# EAGLE design Stand Sensor (EAGLE 6.5.0)
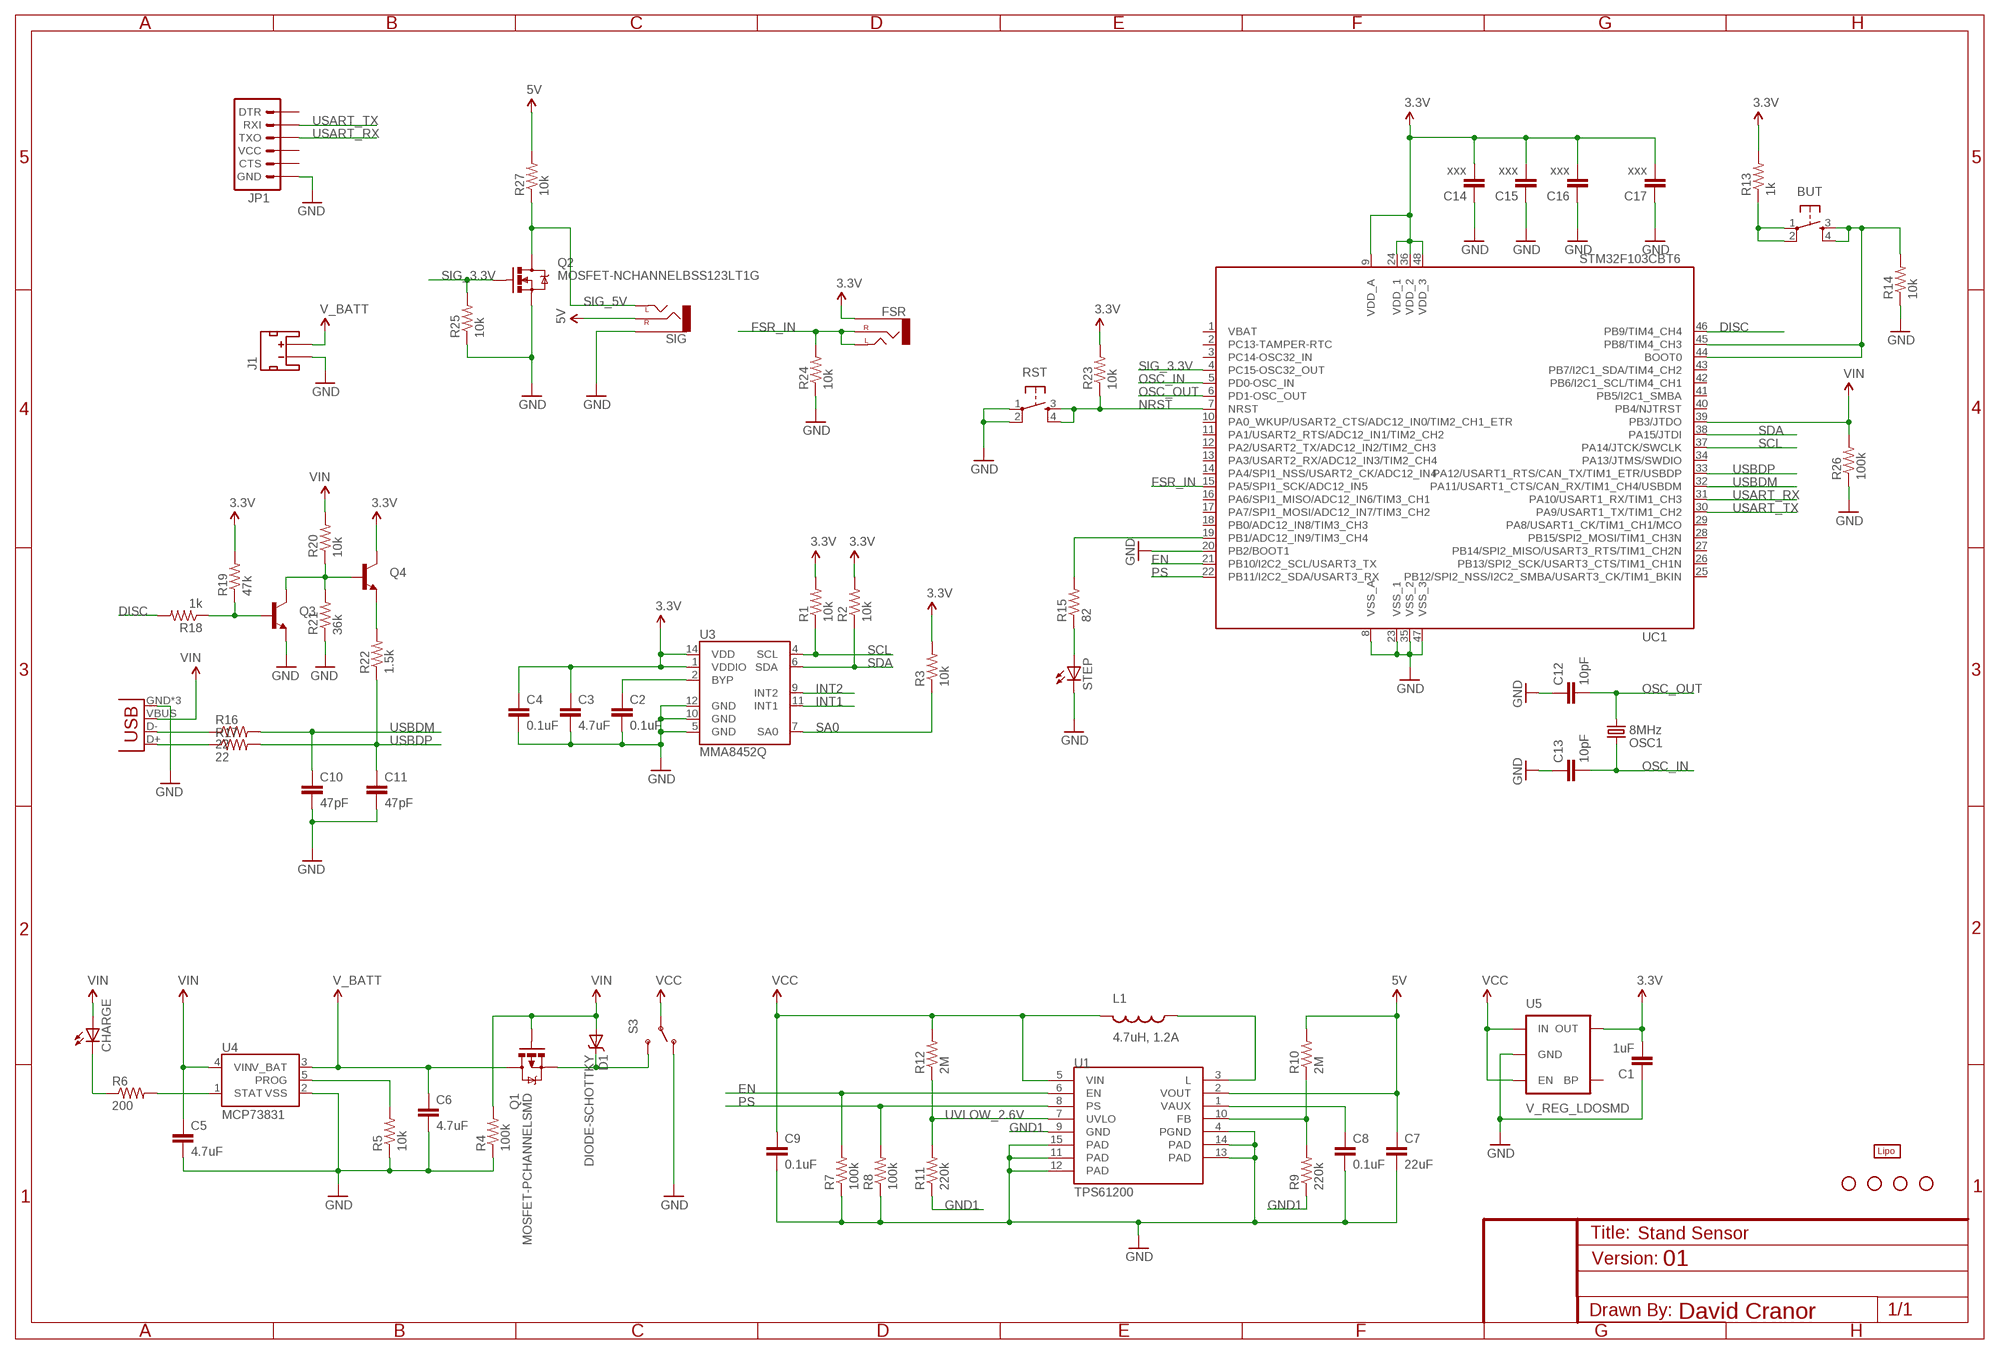
[diagram p0: schematic, sheet 1]

## Parts
BUT  TAC_SWITCHSMD  [TACTILE_SWITCH_SMD]
C1  1uF  CAP1206  [1206]
C2  0.1uF  CAP1206  [1206]
C3  4.7uF  CAP1206  [1206]
C4  0.1uF  CAP1206  [1206]
C5  4.7uF  CAP1206  [1206]
C6  4.7uF  CAP1206  [1206]
C7  22uF  CAP1206  [1206]
C8  0.1uF  CAP1206  [1206]
C9  0.1uF  CAP1206  [1206]
C10  47pF  CAP1206  [1206]
C11  47pF  CAP1206  [1206]
C12  10pF  CAP1206  [1206]
C13  10pF  CAP1206  [1206]
C14  xxx  CAP1206  [1206]
C15  xxx  CAP1206  [1206]
C16  xxx  CAP1206  [1206]
C17  xxx  CAP1206  [1206]
CHARGE  LED1206  [LED-1206]
D1  DIODE-SCHOTTKY  [SOD-523]
FSR  AUDIO-JACKPTH  [AUDIO-JACK]
J1  JST_2MM_MALE  [JST-2-SMD]
JP1  ARDUINO_SERIAL_PROGRAMSMD  [1X06-SMD]
L1  4.7uH, 1.2A  INDUCTOR.  [CDRH2D09]
OSC1  8MHz  CRYSTAL5X3  [CRYSTAL-SMD-5X3]
Q1  MOSFET-PCHANNELSMD  [SOT23-3]
Q2  MOSFET-NCHANNELBSS123LT1G  [SOT23]
Q3  TRANSISTOR_NPNSOT23  [SOT23]
Q4  TRANSISTOR_NPNSOT23  [SOT23]
R1  10k  RESISTOR1206  [1206]
R2  10k  RESISTOR1206  [1206]
R3  10k  RESISTOR1206  [1206]
R4  100k  RESISTOR1206  [1206]
R5  10k  RESISTOR1206  [1206]
R6  200  RESISTOR1206  [1206]
R7  100k  RESISTOR1206  [1206]
R8  100k  RESISTOR1206  [1206]
R9  220k  RESISTOR1206  [1206]
R10  2M  RESISTOR1206  [1206]
R11  220k  RESISTOR1206  [1206]
R12  2M  RESISTOR1206  [1206]
R13  1k  RESISTOR1206  [1206]
R14  10k  RESISTOR1206  [1206]
R15  82  RESISTOR1206  [1206]
R16  22  RESISTOR1206  [1206]
R17  22  RESISTOR1206  [1206]
R18  1k  RESISTOR1206  [1206]
R19  47k  RESISTOR1206  [1206]
R20  10k  RESISTOR1206  [1206]
R21  36k  RESISTOR1206  [1206]
R22  1.5k  RESISTOR1206  [1206]
R23  10k  RESISTOR1206  [1206]
R24  10k  RESISTOR1206  [1206]
R25  10k  RESISTOR1206  [1206]
R26  100k  RESISTOR1206  [1206]
R27  10k  RESISTOR1206  [1206]
RST  TAC_SWITCHSMD  [TACTILE_SWITCH_SMD]
S3  SWITCH-SPDTSMD  [AYZ0202]
SIG  AUDIO-JACKPTH  [AUDIO-JACK]
STANDOFF1  STAND-OFF  [STAND-OFF]
STANDOFF2  STAND-OFF  [STAND-OFF]
STANDOFF3  STAND-OFF  [STAND-OFF]
STANDOFF4  STAND-OFF  [STAND-OFF]
STEP  LED1206  [LED-1206]
U1  TPS61200  [QFN-10_PAD]
U3  MMA8452Q  [QFN-16_0.5MM]
U4  MCP73831  [SOT23-5]
U5  V_REG_LDOSMD  [SOT23-5]
U$1  LIPO-OUTLINE2000  [LIPO-2000]
UC1  STM32F103CBT6  STM32F103CB  [LQFP48]
USB  USB-MICROB  [USB-MICROB]

## Nets
3.3V: C1.2 C3.1 C4.1 C14.2 C15.2 C16.2 C17.2 FSR.SLEEVE Q4.3(C) R1.2 R2.2 R3.2 R13.2 R19.2 R23.2 U3.1(VDDIO) U3.14(VDD) U5.5(OUT) UC1.9(VDD_A) UC1.24(VDD_1) UC1.36(VDD_2) UC1.48(VDD_3)
5V: C7.1 R10.2 R27.2 SIG.RING(RIGHT) U1.2(VOUT)
D+: R17.1 USB.D+
D-: R16.1 USB.D-
DISC: R18.2 UC1.46(PB9/TIM4_CH4)
EN: R7.2 U1.6(EN) UC1.21(PB10/I2C2_SCL/USART3_TX)
FSR_IN: FSR.RING(RIGHT) FSR.TIP(LEFT) R24.2 UC1.15(PA5/SPI1_SCK/ADC12_IN5)
GND: C1.1 C2.2 C3.2 C4.2 C5.2 C6.2 C7.2 C8.2 C9.2 C10.2 C11.2 C12.1 C13.1 C14.1 C15.1 C16.1 C17.1 J1.1(-) JP1.6(GND) Q2.2(S) Q3.2(E) R4.1 R5.1 R7.1 R8.1 R14.1 R21.1 R24.1 R25.1 R26.1 RST.1 RST.2 S3.1(O) SIG.SLEEVE STEP.C U1.4(PGND) U1.11(PAD) U1.12(PAD) U1.13(PAD) U1.14(PAD) U1.15(PAD) U3.5(GND) U3.10(GND) U3.12(GND) U4.2(VSS) U5.2(GND) UC1.8(VSS_A) UC1.20(PB2/BOOT1) UC1.23(VSS_1) UC1.35(VSS_2) UC1.47(VSS_3) USB.GND USB.MT1(GND) USB.MT2(GND)
GND1: R9.1 R11.1 U1.9(GND)
INT1: U3.11(INT1)
INT2: U3.9(INT2)
N$1: C2.1 U3.2(BYP)
N$2: L1.P$1 U1.3(L)
N$3: R5.2 U4.5(PROG)
N$4: R6.2 U4.1(STAT)
N$5: CHARGE.C R6.1
N$6: D1.C Q1.2(S) S3.3(S)
N$7: C8.1 U1.1(VAUX)
N$8: R9.2 R10.1 U1.10(FB)
N$9: R15.2 UC1.19(PB1/ADC12_IN9/TIM3_CH4)
N$10: BUT.3 BUT.4 R14.2 UC1.44(BOOT0) UC1.45(PB8/TIM4_CH3)
N$11: R15.1 STEP.A
N$12: BUT.1 BUT.2 R13.1
N$13: Q3.1(B) R18.1 R19.1
N$14: Q3.3(C) Q4.1(B) R20.1 R21.2
N$18: Q4.2(E) R22.2
NRST: R23.1 RST.3 RST.4 UC1.7(NRST)
OSC_IN: C13.2 OSC1.3 UC1.5(PD0-OSC_IN)
OSC_OUT: C12.2 OSC1.1 UC1.6(PD1-OSC_OUT)
PS: R8.2 U1.8(PS) UC1.22(PB11/I2C2_SDA/USART3_RX)
SA0: R3.1 U3.7(SA0)
SCL: R1.1 U3.4(SCL) UC1.37(PA14/JTCK/SWCLK)
SDA: R2.1 U3.6(SDA) UC1.38(PA15/JTDI)
SIG_3.3V: Q2.1(G) R25.2 UC1.4(PC15-OSC32_OUT)
SIG_5V: Q2.3(D) R27.1 SIG.TIP(LEFT)
USART_RX: JP1.3(TXO) UC1.31(PA10/USART1_RX/TIM1_CH3)
USART_TX: JP1.2(RXI) UC1.30(PA9/USART1_TX/TIM1_CH2)
USBDM: C10.1 R16.2 UC1.32(PA11/USART1_CTS/CAN_RX/TIM1_CH4/USBDM)
USBDP: C11.1 R17.2 R22.1 UC1.33(PA12/USART1_RTS/CAN_TX/TIM1_ETR/USBDP)
UVLOW_2.6V: R11.2 R12.1 U1.7(UVLO)
V_BATT: C6.1 J1.2(+) Q1.3(D) U4.3(V_BAT)
VCC: C9.1 L1.P$2 R12.2 S3.2(P) U1.5(VIN) U5.1(IN) U5.3(EN)
VIN: C5.1 CHARGE.A D1.A Q1.1(G) R4.2 R20.2 R26.2 U4.4(VIN) UC1.39(PB3/JTDO) USB.VBUS
Unconnected: J1.NC1(PAD1) J1.NC2(PAD2) JP1.1(DTR) JP1.4(VCC) JP1.5(CTS) U5.4(BP) UC1.2(PC13-TAMPER-RTC) UC1.3(PC14-OSC32_IN) UC1.10(PA0_WKUP/USART2_CTS/ADC12_IN0/TIM2_CH1_ETR) UC1.11(PA1/USART2_RTS/ADC12_IN1/TIM2_CH2) UC1.12(PA2/USART2_TX/ADC12_IN2/TIM2_CH3) UC1.13(PA3/USART2_RX/ADC12_IN3/TIM2_CH4) UC1.14(PA4/SPI1_NSS/USART2_CK/ADC12_IN4) UC1.16(PA6/SPI1_MISO/ADC12_IN6/TIM3_CH1) UC1.17(PA7/SPI1_MOSI/ADC12_IN7/TIM3_CH2) UC1.18(PB0/ADC12_IN8/TIM3_CH3) UC1.25(PB12/SPI2_NSS/I2C2_SMBA/USART3_CK/TIM1_BKIN) UC1.26(PB13/SPI2_SCK/USART3_CTS/TIM1_CH1N) UC1.27(PB14/SPI2_MISO/USART3_RTS/TIM1_CH2N) UC1.28(PB15/SPI2_MOSI/TIM1_CH3N) UC1.29(PA8/USART1_CK/TIM1_CH1/MCO) UC1.34(PA13/JTMS/SWDIO) UC1.40(PB4/NJTRST) UC1.41(PB5/I2C1_SMBA) UC1.42(PB6/I2C1_SCL/TIM4_CH1) UC1.43(PB7/I2C1_SDA/TIM4_CH2)

## Notes on the sheet
- 01
- David Cranor

## Power pins joined to a net without a drawn wire
VBAT: UC1.1(VBAT)

## Library data of the parts
BUT RST = SparkFun-Electromechanical:TAC_SWITCH: Momentary Switch Button commonly used for reset or general input. Spark Fun Electronics SKU : COM-00097 SMT- SWCH-08247; PROD_ID: SWCH-08247
C1-C17 = SparkFun-Passives:CAP: Capacitor Standard 0603 ceramic capacitor, and 0.1" leaded capacitor.
CHARGE STEP = SparkFun-LED:LED: LEDs Standard schematic elements and footprints for 5mm, 3mm, 1206, and 0603 sized LEDs. 5mm - Spark Fun Electronics SKU : COM-00529 (and others)
D1 = SparkFun-DiscreteSemi:DIODE-SCHOTTKY: Commonly MBRA140.
FSR SIG = SparkFun-Connectors:AUDIO-JACK: 3.5mm Audio Jack Simple 3.5mm common PCB mount audio jack. SKU: PRT-08032
J1 = SparkFun-Connectors:JST_2MM_MALE: Mates to single-cell LiPo batteries. CONN-08352; PROD_ID: CONN-08352
JP1 = SparkFun-Connectors:ARDUINO_SERIAL_PROGRAM: FTDI connector footprints
L1 = SparkFun-Passives:INDUCTOR: Inductors Basic Inductor/Choke - 0603 and 1206. Footprints are not proven and vary greatly between part numbers. SRN6045- 33uH, 20% 1.4A
OSC1 = SparkFun2:CRYSTAL: Crystals Various standard crystals. Proven footprints. Spark Fun Electronics SKU : COM-00534
Q1 = SparkFun-DiscreteSemi:MOSFET-PCHANNEL: Generic PMOSFET
Q2 = SparkFun-DiscreteSemi:MOSFET-NCHANNEL: Common NMOSFET Parts MFG P/N Store ID Prod ID FDD8780 TRANS-09984 SI7820DN TRANS-11055 FDS6630A IC-08089 2N7002PW TRANS-11151 FQP30N06L COM-10213 TRANS-10060 BSS123LT1G TRANS-08345 BSS138 TRANS-00830 BS170 2N7000; PROD_ID: TRANS-08345
Q3 Q4 = SparkFun-DiscreteSemi:TRANSISTOR_NPN: Generic NPN BJT MMBT2222A - TRANS-08049 (SOT-23, 1A 40V) MPSA42 - TRANS-09116 (SOT-23, 500mA 300V) MMBT5088LT1G - TRANS-11160 (SOT-23, 50 mA 30V)
R1-R27 = SparkFun-Passives:RESISTOR: Resistor Basic schematic elements and footprints for 0603, 1206, and PTH resistors.
S3 = SparkFun-Electromechanical:SWITCH-SPDT: SPDT Switch Simple slide switch, Spark Fun Electronics SKU : COM-00102 DPDT SMT slide switch, AYZ0202, SWCH-08179; PROD_ID: SWCH-08179
STANDOFF1-STANDOFF4 = SparkFun-Electromechanical:STAND-OFF: #4 Stand Off This is the mechanical footprint for a #4 phillips button head screw. Use the keepout ring to avoid running the screw head into surrounding components. SKU : PRT-00447
U1 = SparkFun-PowerIC:TPS61200: DC to DC Booster IC-10035; PROD_ID: IC-10035
U3 = SparkFun-Sensors:MMA8452Q: MMA8452Q 3-Axis, 12/8-bit Digital Accelerometer Supply Voltage: 1.6-3.6V Range: +/- 2g, 4g, 8g Interface: I2C, 12-bit and 8-bit ODR: 1.56 Hz - 800 Hz Package: QFN-16 http://cache.freescale.com/files/sensors/doc/data_sheet/MMA8452Q.pdf; PROD_ID: IC-10769
U4 = SparkFun-PowerIC:MCP73831: Miniature single cell, fully integrated Li-Ion, Li-polymer charge management controller http://ww1.microchip.com/downloads/en/DeviceDoc/21984a.pdf IC-09995; PROD_ID: IC-09995
U5 = SparkFun-PowerIC:V_REG_LDO: Voltage Regulator LDO Standard 150mA LDO voltage regulator in SOT-23 layout. Micrel part MIC5205. BP (by-pass) pin is used to lower output noise with 470pF cap.
U$1 = SparkFun-Electromechanical:LIPO-OUTLINE: Outlines for common LiPo batteries sold by SparkFun. For fit only- no pads or connectors!
UC1 = stm32:STM32F103CB
USB = SparkFun-Connectors:USB: USB Connectors USB-B-PTH is fully proven SKU : PRT-00139/CONN-08278 USB-miniB is fully proven SKU : PRT-00587 USB-A-PCB is untested. USB-A-H is throughly reviewed, but untested. Spark Fun Electronics SKU : PRT-00437 USB-B-SMT is throughly reviewed, but untested. Needs silkscreen touching up. USB-A-S has not been used/tested USB-MB-H has not been used/tested USB-MICROB has been used. CONN-09505; PROD_ID: CONN-09505

## Board
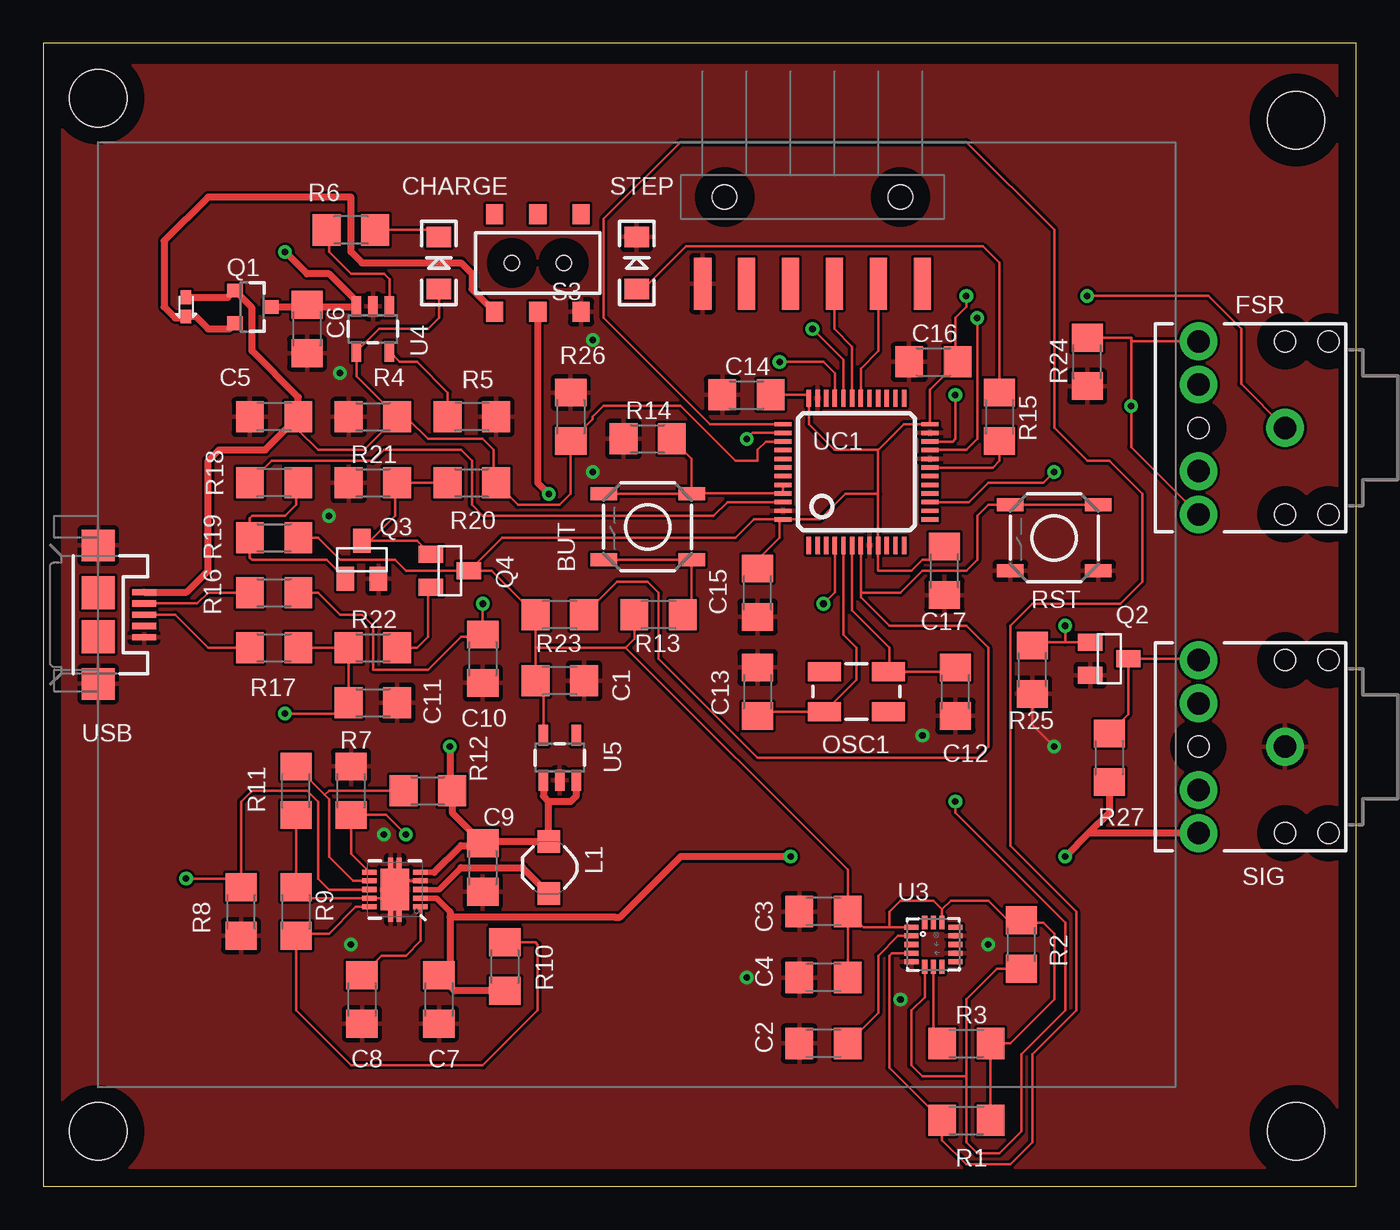
[diagram p1: board, top side]
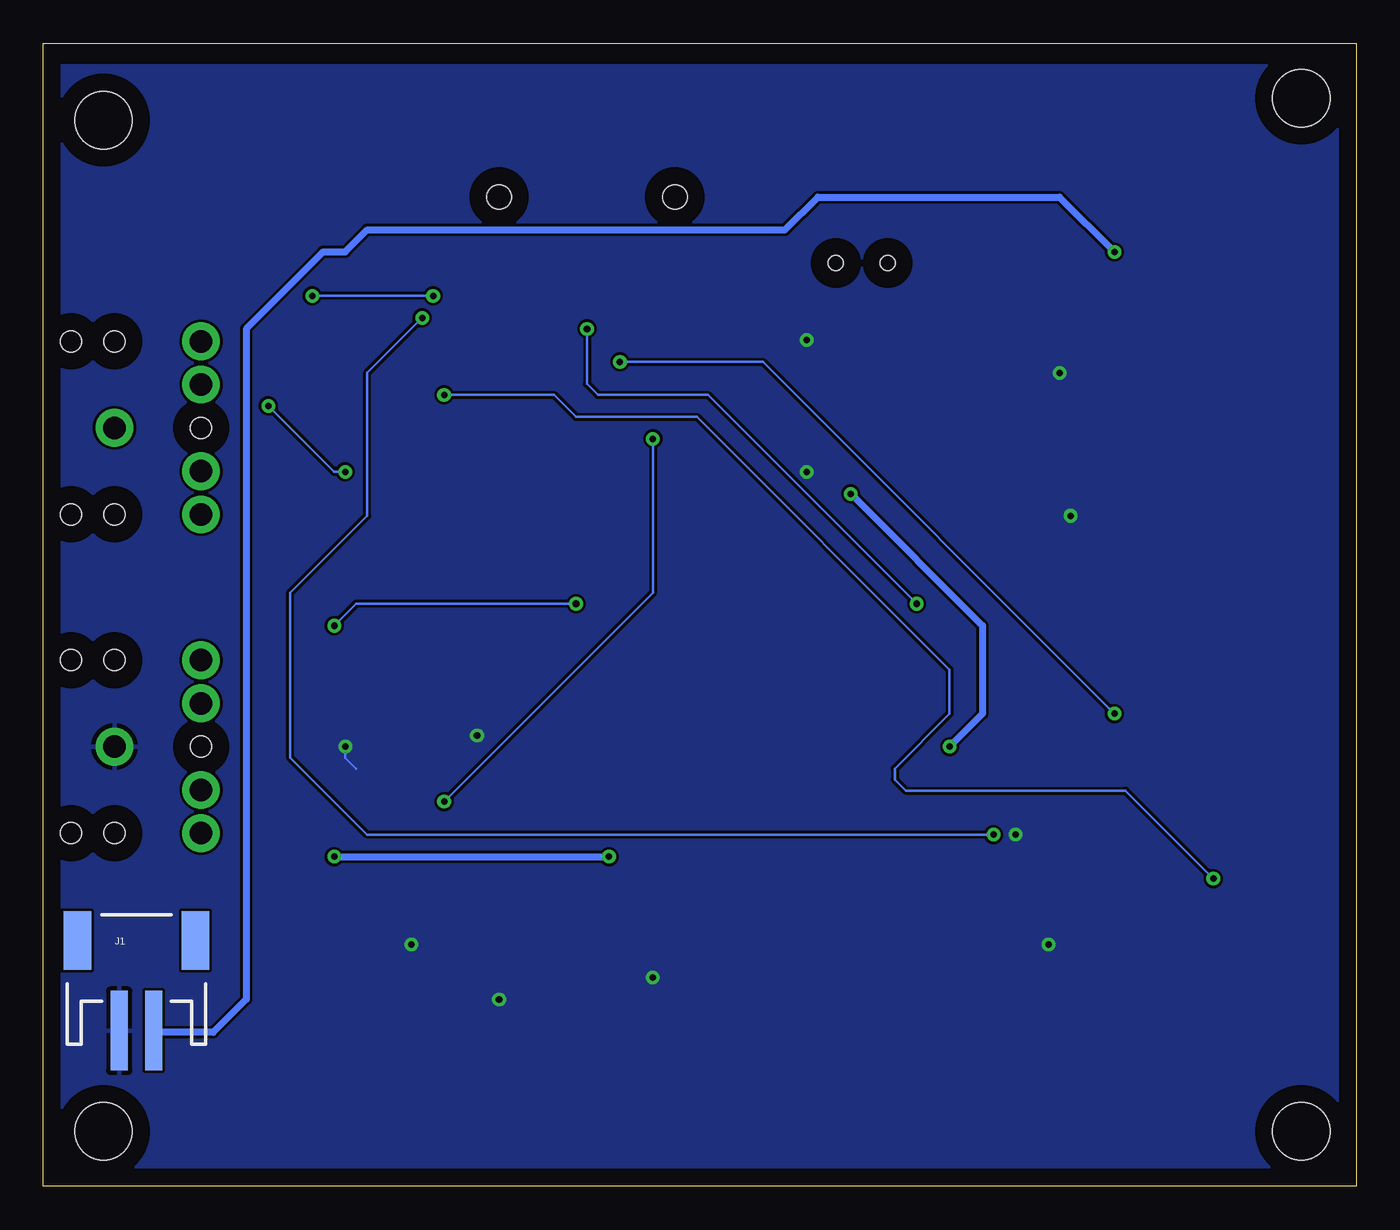
[diagram p2: board, bottom side, seen from below]

Size 75.87 x 66.03 mm. Coordinates in mm from the lower left corner, seen from the top.
Outline: 0,0 75.87,0 75.87,66.03 0,66.03 0,0
Copper layers (1*16): Top 0.035mm / dielectric 1.5mm / Bottom 0.035mm
Design rules "default *": minimum track width 6mil, minimum drill 15mil, track to track 6mil, track to pad 6mil, pad to pad 6mil, via to via 6mil, smd to smd 6mil, copper to edge 40mil, drill to drill 6mil, minimum pad ring 10mil, minimum via ring 8mil, stop-mask expansion 4mil, vias tented up to drill 0mil, thermal gap 10mil

### Footprints (pad centres in the part's own frame; a part is rotated, then mirrored left to right if it is on the bottom)
TACTILE_SWITCH_SMD = smd 1.524 x 0.762: 1 -2.54,1.905; 2 2.54,1.905; 3 -2.54,-1.905; 4 2.54,-1.905
1206 = smd 1.6 x 1.8: 1 -1.4,0; 2 1.4,0
LED-1206 = smd 1.2 x 1.4: A -1.5,0; C 1.5,0
SOD-523 = smd 0.8 x 0.6: A -0.55,0; C 0.55,0
AUDIO-JACK = drill 1.3 pad 2.184: RING 5,5; RSH 5,2.5; SLEEVE 0,0; TIP 5,-5; TSH 5,-2.5 | hole 1.2: 0,5; -2.5,5; -2.5,-5; 0,-5; 5,0
JST-2-SMD = smd 1 x 4.6: 1 -1,-3.7; 2 1,-3.7 | smd 1.6 x 3.4: NC1 -3.4,1.5; NC2 3.4,1.5
1X06-SMD = smd 1 x 3: 1 -6.35,5; 2 -3.81,5; 3 -1.27,5; 4 1.27,5; 5 3.81,5; 6 6.35,5 | hole 1.4: -5.08,0; 5.08,0
CDRH2D09 = smd 1.3 x 1.3: P$1 -1.5,0; P$2 1.5,0
CRYSTAL-SMD-5X3 = smd 1.9 x 1.1: 1 -1.85,-1.15; 2 1.85,-1.15; 3 1.85,1.15; 4 -1.85,1.15
SOT23-3 = smd 0.8 x 0.9: 1 -0.95,-1; 2 0.95,-1; 3 0,1.1
SOT23 = smd 1 x 1.4: 1 -0.95,-1.1; 2 0.95,-1.1; 3 0,1.1
AYZ0202 = smd 1 x 1.15: 1 -2.5,2.825; 2 0,2.825; 3 2.5,2.825; 4 -2.5,-2.825; 5 0,-2.825; 6 2.5,-2.825 | hole 0.85: 1.5,0; -1.5,0
STAND-OFF = hole 3.302: 0,0
QFN-10_PAD = smd 0.297 x 0.85: 1 -1,-1.475; 2 -0.5,-1.475; 3 0,-1.475; 4 0.5,-1.475; 5 1,-1.475; 6 1,1.475; 7 0.5,1.475; 8 0,1.475; 9 -0.5,1.475; 10 -1,1.475 | smd 0.7 x 0.28: 11 -1.5,0.25; 12 -1.5,-0.25; 13 1.5,0.25; 14 1.5,-0.25 | smd 2.4 x 1.65: 15 0,0
QFN-16_0.5MM = smd 0.8 x 0.3: 1 -1.275,1; 2 -1.275,0.5; 3 -1.275,0; 4 -1.275,-0.5; 5 -1.275,-1; 9 1.275,-1; 10 1.275,-0.5; 11 1.275,0; 12 1.275,0.5; 13 1.275,1 | smd 0.3 x 0.8: 6 -0.5,-1.275; 7 0,-1.275; 8 0.5,-1.275; 14 0.5,1.275; 15 0,1.275; 16 -0.5,1.275
SOT23-5 = smd 0.55 x 1.2: 1 -0.95,-1.3; 2 0,-1.3; 3 0.95,-1.3; 4 0.95,1.3; 5 -0.95,1.3
LQFP48 = smd 0.254 x 1: 1 -2.75,-4.25; 2 -2.25,-4.25; 3 -1.75,-4.25; 4 -1.25,-4.25; 5 -0.75,-4.25; 6 -0.25,-4.25; 7 0.25,-4.25; 8 0.75,-4.25; 9 1.25,-4.25; 10 1.75,-4.25; 11 2.25,-4.25; 12 2.75,-4.25; 25 2.75,4.25; 26 2.25,4.25; 27 1.75,4.25; 28 1.25,4.25; 29 0.75,4.25; 30 0.25,4.25; 31 -0.25,4.25; 32 -0.75,4.25; 33 -1.25,4.25; 34 -1.75,4.25; 35 -2.25,4.25; 36 -2.75,4.25 | smd 1 x 0.254: 13 4.25,-2.75; 14 4.25,-2.25; 15 4.25,-1.75; 16 4.25,-1.25; 17 4.25,-0.75; 18 4.25,-0.25; 19 4.25,0.25; 20 4.25,0.75; 21 4.25,1.25; 22 4.25,1.75; 23 4.25,2.25; 24 4.25,2.75; 37 -4.25,2.75; 38 -4.25,2.25; 39 -4.25,1.75; 40 -4.25,1.25; 41 -4.25,0.75; 42 -4.25,0.25; 43 -4.25,-0.25; 44 -4.25,-0.75; 45 -4.25,-1.25; 46 -4.25,-1.75; 47 -4.25,-2.25; 48 -4.25,-2.75
USB-MICROB = smd 0.35 x 1.4: D+ 0,2.65; D- -0.65,2.65; GND 1.3,2.65; ID 0.65,2.65; VBUS -1.3,2.65 | smd 1.8 x 1.9: MT1 -4,0; MT2 4,0 | smd 1.9 x 1.9: P$1 -1.27,0; P$2 1.27,0

### Placement (x,y rotation side)
BUT  34.92,38.1 180 top
C1  29.84,29.21 180 top
C2  45.09,8.26 180 top
C3  45.09,15.88 180 top
C4  45.09,12.06 180 top
C5  13.34,44.45 180 top
C6  15.24,49.53 270 top
C7  22.86,10.79 270 top
C8  18.41,10.79 270 top
C9  25.4,18.41 270 top
C10  25.4,30.48 270 top
C11  19.05,27.94 0 top
C12  52.7,28.57 90 top
C13  41.27,28.57 270 top
C14  40.64,45.72 0 top
C15  41.27,34.29 90 top
C16  51.44,47.62 0 top
C17  52.07,35.56 90 top
CHARGE  22.86,53.34 90 top
D1  8.26,50.8 270 top
FSR  71.75,43.81 180 top
J1  70.48,12.7 0 bottom
JP1  44.45,57.15 180 top
L1  29.21,18.41 90 top
OSC1  46.99,28.57 180 top
Q1  12.06,50.8 270 top
Q2  61.59,30.48 270 top
Q3  18.41,36.2 0 top
Q4  23.5,35.56 270 top
R1  53.34,3.81 0 top
R2  56.52,13.97 90 top
R3  53.34,8.26 0 top
R4  19.05,44.45 0 top
R5  24.77,44.45 180 top
R6  17.78,55.24 180 top
R7  17.78,22.86 270 top
R8  11.43,15.88 90 top
R9  14.61,15.88 270 top
R10  26.67,12.7 270 top
R11  14.61,22.86 90 top
R12  22.23,22.86 0 top
R13  35.56,33.02 180 top
R14  34.92,43.18 0 top
R15  55.24,44.45 270 top
R16  13.34,34.29 0 top
R17  13.34,31.11 0 top
R18  13.34,40.64 180 top
R19  13.34,37.47 0 top
R20  24.77,40.64 0 top
R21  19.05,40.64 0 top
R22  19.05,31.11 0 top
R23  29.84,33.02 180 top
R24  60.33,47.62 90 top
R25  57.15,29.84 90 top
R26  30.48,44.45 270 top
R27  61.59,24.77 270 top
RST  58.42,37.47 180 top
S3  28.57,53.34 180 top
SIG  71.75,25.4 180 top
STANDOFF1  3.17,3.17 0 top
STANDOFF2  72.39,3.17 0 top
STANDOFF3  3.17,62.87 0 top
STANDOFF4  72.39,61.59 0 top
STEP  34.29,53.34 90 top
U1  20.32,17.14 90 top
U3  51.44,13.97 0 top
U4  19.05,49.53 180 top
U5  29.84,24.77 0 top
U$1  3.17,5.71 0 top
UC1  46.99,41.27 0 top
USB  3.17,33.02 270 top

### Tracks (layer width: path | path; a pad name or v marks a point on that pad's centre or on a via)
3.3V  (via drill 0.38)
  Top 0.152: Q4.3 20.95,35.56 20.32,36.2 17.14,36.2 15.88,37.47 R19.2 | C3.1 C4.1 | U3.1 48.9,14.97 | 48.9,14.97 47.39,14.97 C3.1 | R1.2 R3.2 55.88,8.26 58.42,10.79 58.42,14.61 57.78,15.24 56.38,15.24 | 56.38,15.24 55.88,15.24 54.61,16.51 52.44,16.51 51.94,16.01 | 56.38,15.24 R2.2 | U3.14 51.94,16.01 | 51.94,16.01 51.44,16.51 49.53,16.51 48.9,15.88 48.9,14.97 | U5.5 28.89,28.76 C1.2 28.45,31.11 | 28.45,31.11 R23.2 25.91,35.56 Q4.3 | R13.2 34.16,31.62 33.66,31.11 | 33.66,31.11 28.45,31.11 | 48.24,40.01 48.24,42.52 | 48.24,42.52 49.74,44.02 UC1.24 51.24,46.03 C16.2 52.7,47.76 52.7,50.16 53.34,50.8 v53.34,51.44 | 48.24,42.52 48.22,42.55 45.72,42.55 44.24,44.02 UC1.36 44.05,45.72 C14.2 | UC1.48 44.88,38.52 46.35,40.01 48.24,40.01 | UC1.48 41.06,38.52 40.01,37.47 26.5,37.47 Q4.3 | C3.1 46.48,18.29 33.66,31.11 | v60.33,51.44 67.31,51.44 69.22,49.53 69.22,46.35 FSR.SLEEVE | C15.2 41.27,36.2 42.55,37.47 42.55,38.33 UC1.48 | C17.2 51.3,36.2 50.8,36.2 50.16,35.56 48.26,35.56 48.24,35.58 UC1.9 48.24,40.01
  Bottom 0.152: v53.34,51.44 v60.33,51.44
5V  (via drill 0.38)
  Top 0.152: 23.5,12.83 C7.1 | 66.83,20.32 SIG.RING
  Top 0.305: U1.2 22.73,16.64 23.5,15.88
  Top 0.406: 23.5,15.88 23.5,15.56 | 23.5,15.56 23.5,12.83 | R10.2 23.75,11.3 C7.1 | 23.5,15.56 33.02,15.56 33.34,15.56 36.83,19.05 v43.18,19.05 | SIG.RING 60.41,20.4 | 60.41,20.4 v59.05,19.05 | R27.2 61.59,21.59 60.41,20.4
  Bottom 0.406: v59.05,19.05 v43.18,19.05
D+
  Top 0.152: USB.D+ 7.62,33.02 9.53,31.11 R17.1
D-
  Top 0.152: USB.D- 8.9,33.67 9.53,34.29 R16.1
DISC
  Top 0.152: UC1.46 39.52,39.52 38.73,38.73 25.4,38.73 24.77,39.37 24.77,41.91 24.13,42.55 19.68,42.55 19.05,41.91 13.21,41.91 R18.2
EN  (via drill 0.38)
  Top 0.152: U1.6 17.78,19.21 R7.2 19.82,21.46 v20.95,20.32 | v53.98,50.16 53.98,43.18 53.34,42.55 51.26,42.55 UC1.21
  Bottom 0.152: v20.95,20.32 57.15,20.32 61.59,24.77 61.59,34.29 57.15,38.73 57.15,46.99 v53.98,50.16
FSR_IN  (via drill 0.38)
  Top 0.152: R24.2 62.87,49.02 62.87,48.9 | UC1.15 53.49,39.52 54.61,40.64 57.78,40.64 v58.42,41.27 | 62.87,48.9 v62.87,45.09 62.87,42.7 FSR.RING | FSR.TIP 62.95,48.81 62.87,48.9
  Bottom 0.152: v58.42,41.27 59.05,41.27 v62.87,45.09
GND  (via drill 0.38)
  Top 0.152: R25.1 57.15,26.67 v58.42,25.4 | U1.11 20.07,16.89 U1.15 20.82,17.64 U1.4
  Bottom 0.152: v58.42,25.4 58.42,24.77 57.78,24.13
  other vias: 50.8,26.04 40.64,12.06 54.61,13.97 49.53,10.79 19.68,20.32 17.78,13.97 17.14,46.99 16.51,38.73 31.75,48.9 31.75,41.27
  pour Top: 0,64.77 76.2,64.77 76.2,0 0,0
  pour Bottom: 0,64.77 76.2,64.77 76.2,0.64 76.2,0 0,0
GND1
  Top 0.152: R11.1 R9.1 15.23,16.64 U1.9 20.18,16.64 20.32,16.51
N$1
  Top 0.152: U3.2 49.4,14.47 48.26,13.34 48.26,10.03 C2.1
N$2
  Top 0.305: U1.3 22.86,17.14 24.13,18.41
  Top 0.406: 24.13,18.41 27.71,18.41 L1.P$1
N$3
  Top 0.152: R5.2 23.36,45.85 21.59,47.62 20.61,47.62 U4.5
N$4
  Top 0.152: U4.1 20,52.39 19.68,52.7 17.78,52.7 16.51,53.98 16.51,55.12 R6.2
N$5
  Top 0.152: R6.1 22.45,55.24 CHARGE.C
N$6
  Top 0.152: 10.74,49.53 Q1.2 | 8.17,50.16 D1.C
  Top 0.406: D1.C 8.8,50.25 9.53,49.53 10.74,49.53 | 8.17,50.16 7.62,50.16 6.99,50.8 6.99,54.61 9.53,57.15 17.78,57.15 17.78,53.98 18.41,53.34 24.13,53.34 24.77,52.7 24.77,51.83 S3.3
N$7
  Top 0.152: U1.1 21.8,14.18 20.95,13.34 19.55,13.34 C8.1
N$8
  Top 0.152: U1.10 18.05,16.14 16.51,14.61 14.73,14.61 R9.2 14.61,10.16 17.78,6.99 25.4,6.99 28.57,10.16 28.57,13.97 28.45,14.1 R10.1
N$9
  Top 0.152: UC1.19 54.86,41.52 55.24,41.91 R15.2
N$10
  Top 0.152: BUT.4 BUT.3 | BUT.3 37.47,42.04 R14.2 | UC1.44 UC1.45 37.48,40.02 BUT.3
N$11
  Top 0.152: R15.1 55.24,53.34 54.29,54.29 37.15,54.29 34.7,51.84 STEP.A
N$12
  Top 0.152: BUT.2 BUT.1 37.47,33.52 R13.1
N$13
  Top 0.152: R18.1 14.61,40.51 14.61,39.37 13.97,38.73 12.06,38.73 11.94,38.6 R19.1 11.94,36.33 12.06,36.2 16.36,36.2 Q3.1
N$14
  Top 0.152: R20.1 R21.2 20.32,40.51 20.32,38.73 18.88,37.3 Q3.3 21.61,37.3 Q4.1
N$18
  Top 0.152: R22.2 21.59,31.11 22.23,31.75 22.23,34.44 Q4.2
NRST
  Top 0.152: RST.3 RST.4 54.61,39.37 53.98,38.73 53.98,36.2 53.34,35.56 50.8,35.56 49.53,34.29 47.24,34.29 | UC1.7 47.24,34.29 | 47.24,34.29 47.24,34.04 48.9,32.38 53.34,32.38 54.61,31.11 54.61,25.4 53.98,24.77 41.27,24.77 35.56,30.48 35.56,34.29 34.92,34.92 33.15,34.92 R23.1
OSC_IN
  Top 0.152: UC1.5 46.24,31.86 46.99,31.11 46.99,29.27 OSC1.3 41.52,27.43 C13.2
OSC_OUT
  Top 0.152: UC1.6 46.74,33.27 48.9,31.11 48.9,29.78 OSC1.1 52.45,29.73 C12.2
PS  (via drill 0.38)
  Top 0.152: U1.8 16.51,17.14 15.88,17.78 15.88,22.23 15.24,22.86 12.06,22.86 11.43,22.23 R8.2 10.93,17.78 v8.26,17.78 | UC1.22 52.55,43.02 52.7,43.18 v52.7,45.72
  Bottom 0.152: v52.7,45.72 46.35,45.72 45.09,44.45 38.1,44.45 23.5,29.84 23.5,27.3 26.67,24.13 26.67,23.5 26.04,22.86 13.34,22.86 v8.26,17.78
SA0
  Top 0.152: U3.7 51.44,8.76 R3.1
SCL
  Top 0.152: U3.4 49.03,13.47 48.9,13.34 48.9,6.86 R1.1 51.94,2.67 53.34,1.27 55.88,1.27 57.15,2.54 57.15,7.62 59.69,10.16 59.69,15.88 55.88,19.68 55.88,32.38 57.15,33.66 62.23,33.66 63.5,34.92 63.5,40.01 61.59,41.91 60.33,41.91 58.42,43.81 58.42,55.24 53.34,60.33 36.83,60.33 32.38,55.88 32.38,50.16 38.52,44.02 UC1.37
SDA  (via drill 0.38)
  Top 0.152: R2.1 55.12,12.57 53.34,10.79 53.34,6.35 | 53.34,6.35 50.8,6.35 50.16,6.99 50.16,10.16 50.94,10.93 U3.6 | 53.34,6.35 53.34,2.54 53.98,1.91 55.24,1.91 56.52,3.17 56.52,7.62 59.05,10.16 59.05,15.24 52.7,21.59 v52.7,22.23 | UC1.38 40.98,43.52 v40.64,43.18
  Bottom 0.152: v40.64,43.18 40.64,34.29 v52.7,22.23
SIG_3.3V  (via drill 0.38)
  Top 0.152: Q2.1 59.05,31.43 | 59.05,31.43 57.34,31.43 R25.2 | UC1.4 45.74,34.31 v45.09,33.66 | v59.05,32.38 59.05,31.43
  Bottom 0.152: v45.09,33.66 57.78,33.66 v59.05,32.38
SIG_5V
  Top 0.152: SIG.TIP 66.67,30.48 Q2.3 62.7,27.27 R27.1
USART_RX
  Top 0.152: UC1.31 46.74,48.51 45.72,49.53 JP1.3
USART_TX
  Top 0.152: UC1.30 47.24,47.24 48.26,48.26 JP1.2
USBDM  (via drill 0.38)
  Top 0.152: R16.2 15.88,34.29 17.14,33.02 18.41,33.02 19.05,32.38 19.05,29.84 22.23,29.84 24.13,31.75 25.27,31.75 C10.1 v25.4,33.66 | UC1.32 46.24,47.74 v44.45,49.53
  Bottom 0.152: v44.45,49.53 44.45,46.35 43.81,45.72 37.47,45.72 v25.4,33.66
USBDP  (via drill 0.38)
  Top 0.152: R17.2 R22.1 C11.1 17.02,27.3 v13.97,27.3 | UC1.33 45.74,46.97 45.09,47.62 v42.55,47.62
  Bottom 0.152: v42.55,47.62 34.29,47.62 v13.97,27.3
UVLOW_2.6V
  Top 0.152: U1.7 17.91,17.64 16.51,19.05 16.51,22.36 16.26,22.61 | 16.26,22.61 R11.2 | R12.1 16.51,22.86 16.26,22.61
V_BATT  (via drill 0.38)
  Top 0.152: 16,50.8 C6.1 15.11,50.8 | 18.07,50.8 U4.3 18.1,51.12
  Top 0.406: 16,50.8 18.07,50.8 | Q1.3 15.11,50.8 | 18.1,51.12 16.51,52.7 15.24,52.7 v13.97,53.98
  Bottom 0.152: 69.38,8.89 J1.2
  Bottom 0.406: v13.97,53.98 17.14,57.15 31.11,57.15 33.02,55.24 57.15,55.24 58.42,53.98 59.69,53.98 64.14,49.53 64.14,10.79 66.04,8.89 69.38,8.89
VCC  (via drill 0.38)
  Top 0.152: 25.5,19.91 C9.1 25.27,19.68 | 28.86,23.5 U5.1 | 23.5,22.99 R12.2
  Top 0.305: U1.5 22.59,18.14
  Top 0.406: 25.5,19.91 L1.P$2 29.21,22.23 | 22.59,18.14 24.13,19.68 25.27,19.68 | R12.2 23.62,21.59 C9.1 | U5.3 30.8,22.54 30.48,22.23 29.21,22.23 | U5.1 28.89,22.54 29.21,22.23 | S3.2 28.57,40.64 v29.21,40.01 | v23.5,25.4 23.5,22.99
  Bottom 0.406: v29.21,40.01 21.59,32.38 21.59,27.3 v23.5,25.4
VIN
  Top 0.152: C5.1 14.73,43.69 15.88,42.55 18.55,42.55 R4.2 | R4.2 20.45,44.32 21.09,44.32 22.23,43.18 25.4,43.18 26.04,42.55 26.04,40.77 R20.2 27.43,39.37 29.84,39.37 30.48,40.01 R26.2 31.75,44.32 31.75,44.45 32.38,45.09 36.83,45.09 40.01,41.91 41.27,41.91 41.27,42.55 41.76,43.02 UC1.39 | CHARGE.A 22.86,50.16 22.23,49.53 19.4,49.53 U4.4 18.1,46.8 R4.2
  Top 0.406: USB.VBUS 8.29,34.32 9.53,35.56 9.53,41.91 10.16,42.55 12.83,42.55 C5.1 14.73,45.59 12.06,48.26 12.06,50.75 Q1.1 10.66,51.35 D1.A